# EAGLE board fmcboard_v1.5 (EAGLE 9.6.2), part 1 of 2
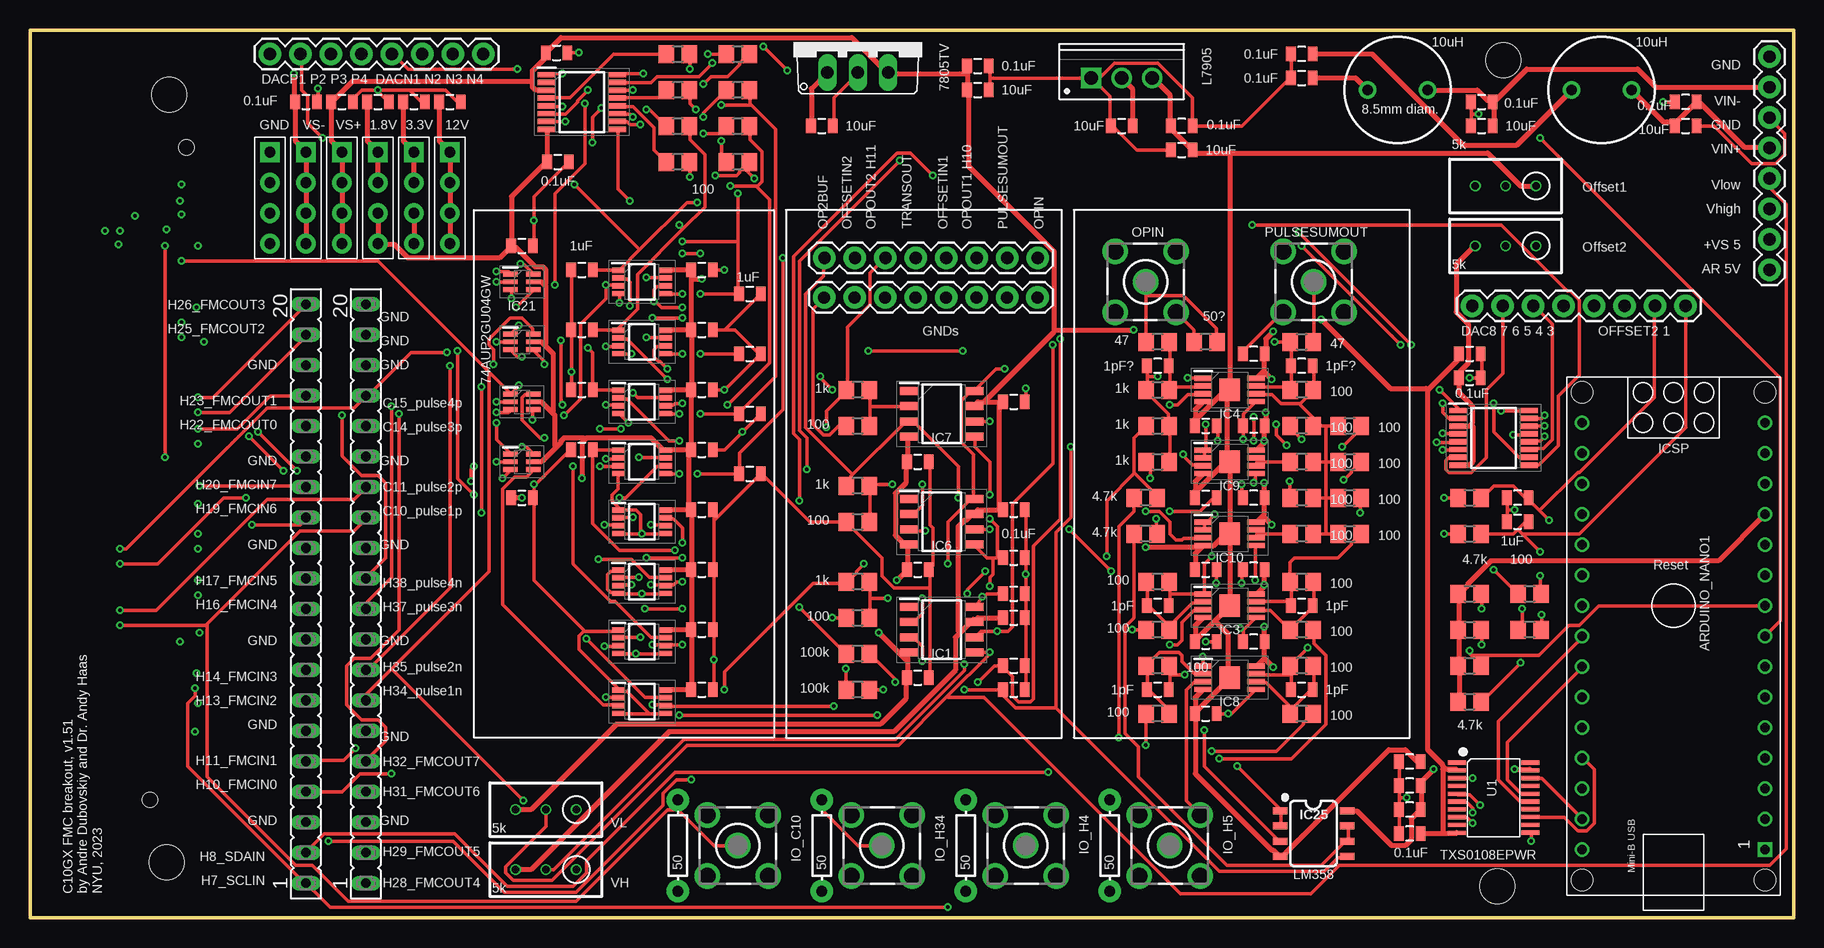
[diagram p4: board, top side]
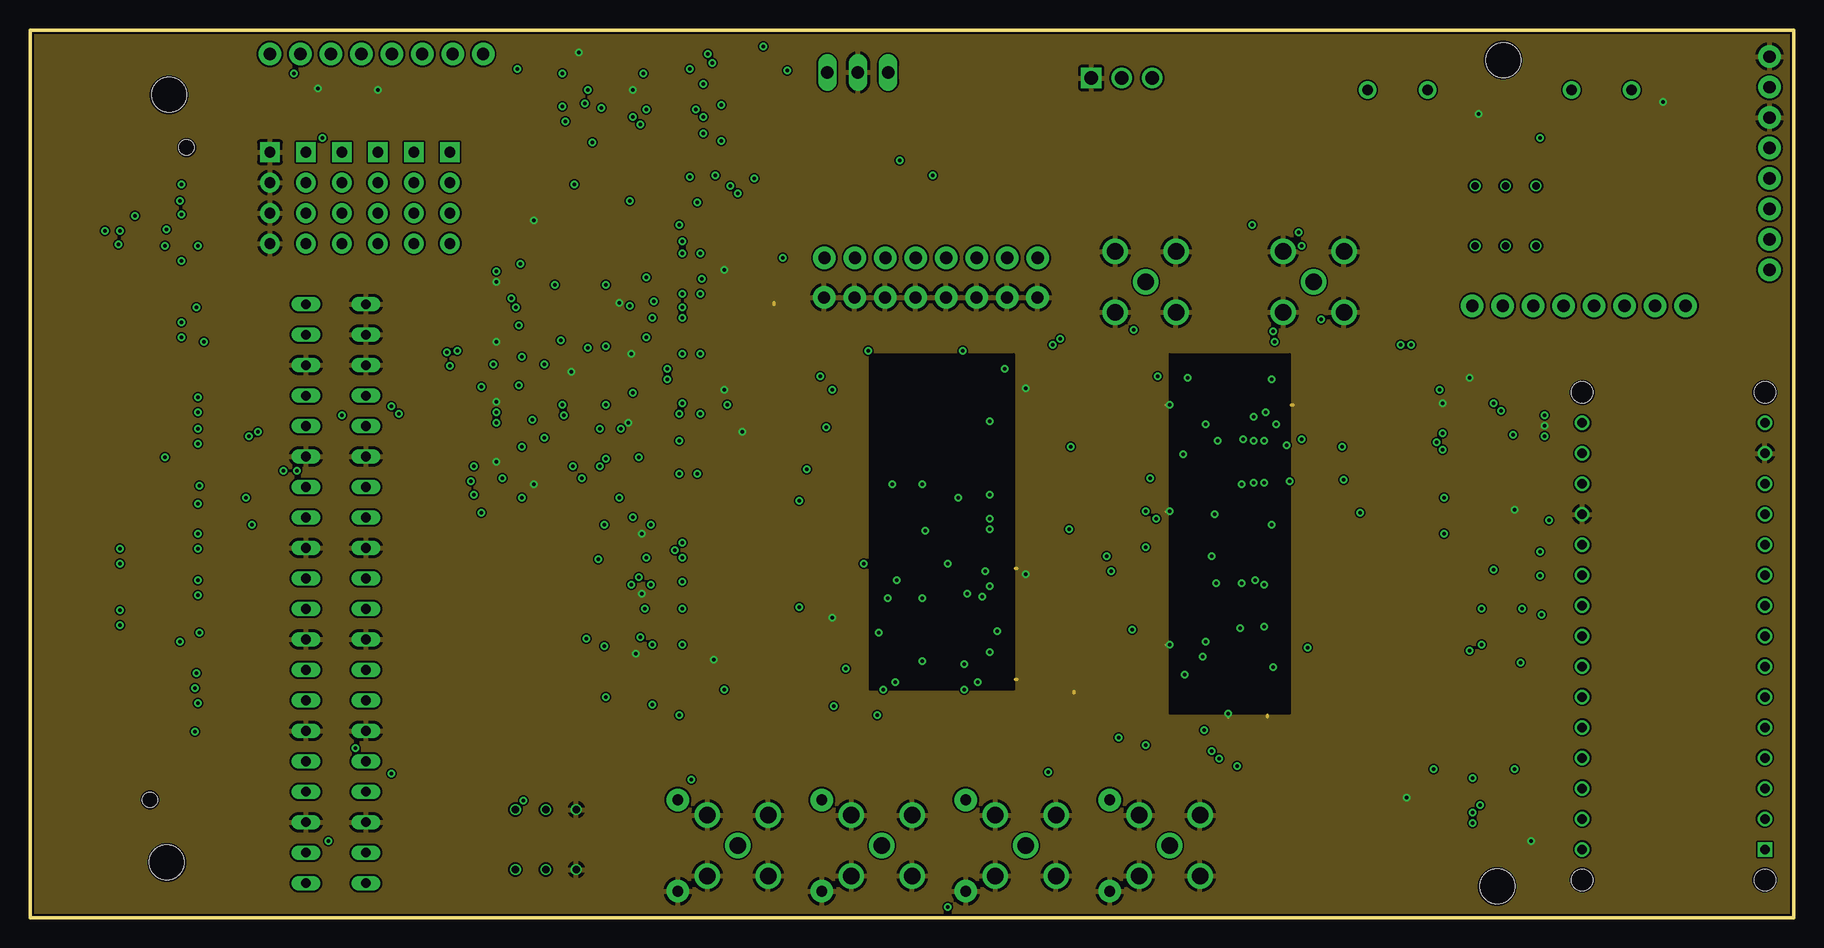
[diagram p5: board, inner layer topgnd]
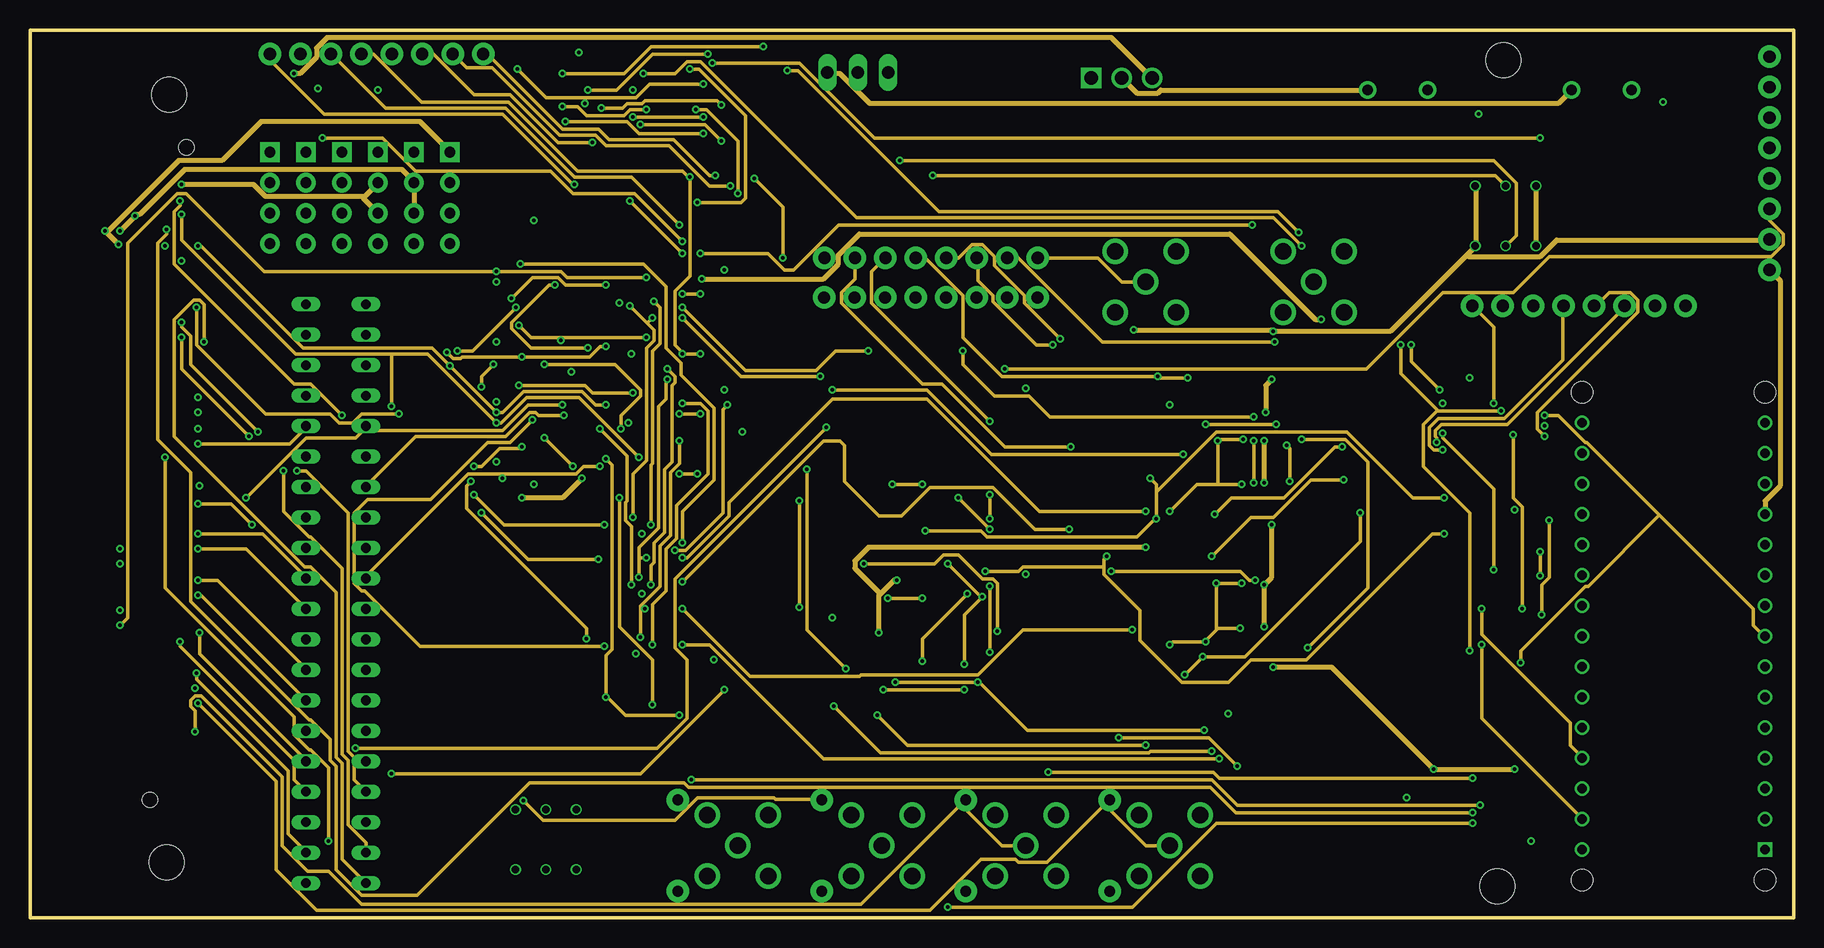
[diagram p6: board, inner layer route]
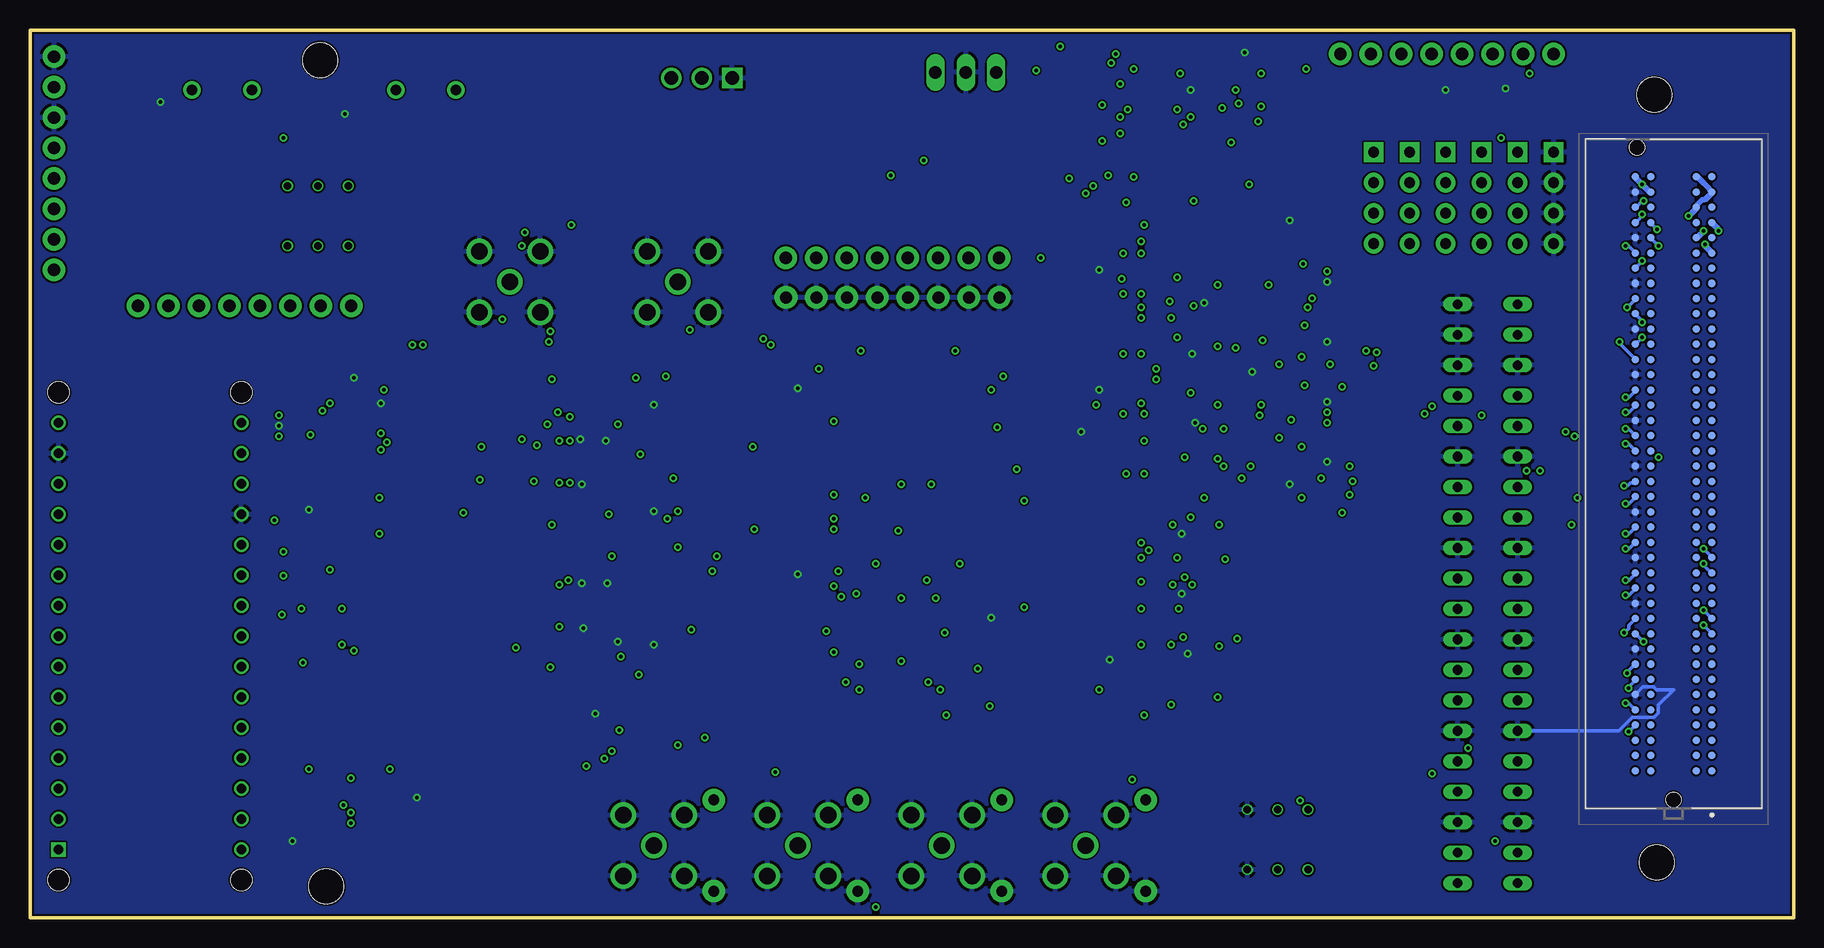
[diagram p7: board, bottom side, seen from below]

Size 147 x 74 mm. Coordinates in mm from the lower left corner, seen from the top.
Outline: 0,74 0,0 147,0 147,74 0,74
Copper layers (1*2*15*16): top 0.035mm / dielectric 0.2mm / topgnd 0.0175mm / dielectric 0.3mm / route 0.0175mm / dielectric 0.2mm / gnd 0.035mm
Design rules "Seeed_AllPCB_MacroFab_haas6mil": minimum track width 6mil, minimum drill 12mil, track to track 6mil, track to pad 6mil, pad to pad 6mil, via to via 6mil, smd to smd 0mil, copper to edge 6mil, drill to drill 6mil, minimum pad ring 6mil, minimum via ring 6mil, stop-mask expansion 6mil, vias tented up to drill 25mil, thermal gap 10mil
Net classes: 0 default: width 0.305 mm; 1 power: width 0.406 mm
Holes 2.9 mm at 11.4,4.6 122.8,71.5 11.6,68.6 122.3,2.6

## Footprints (pad centres in the part's own frame; a part is rotated, then mirrored left to right if it is on the bottom)
ARDUINO_NANO = drill 0.8 square: 1 -20.32,-7.62 | drill 0.8: 2 -17.78,-7.62; 3 -15.24,-7.62; 4 -12.7,-7.62; 5 -10.16,-7.62; 6 -7.62,-7.62; 7 -5.08,-7.62; 8 -2.54,-7.62; 9 0,-7.62; 10 2.54,-7.62; 11 5.08,-7.62; 12 7.62,-7.62; 13 10.16,-7.62; 14 12.7,-7.62; 15 15.24,-7.62; 16 15.24,7.62; 17 12.7,7.62; 18 10.16,7.62; 19 7.62,7.62; 20 5.08,7.62; 21 2.54,7.62; 22 0,7.62; 23 -2.54,7.62; 24 -5.08,7.62; 25 -7.62,7.62; 26 -10.16,7.62; 27 -12.7,7.62; 28 -15.24,7.62; 29 -17.78,7.62; 30 -20.32,7.62 | hole 1.778: -22.86,-7.62; -22.86,7.62; 17.78,7.62; 17.78,-7.62
0805 = smd 0.8 x 1.2: 1 -0.9,0; 2 0.9,0
SOIC127P600X175-8N = smd 1.528 x 0.65: 1 -2.711,1.905; 2 -2.711,0.635; 3 -2.711,-0.635; 4 -2.711,-1.905; 5 2.711,-1.905; 6 2.711,-0.635; 7 2.711,0.635; 8 2.711,1.905
SOP65P640X120-16N = smd 1.475 x 0.45: 1 -2.938,2.275; 2 -2.938,1.625; 3 -2.938,0.975; 4 -2.938,0.325; 5 -2.938,-0.325; 6 -2.938,-0.975; 7 -2.938,-1.625; 8 -2.938,-2.275; 9 2.938,-2.275; 10 2.938,-1.625; 11 2.938,-0.975; 12 2.938,-0.325; 13 2.938,0.325; 14 2.938,0.975; 15 2.938,1.625; 16 2.938,2.275
SOP65P490X110-9N = smd 1.425 x 0.45: 1 -2.212,0.975; 2 -2.212,0.325; 3 -2.212,-0.325; 4 -2.212,-0.975; 5 2.212,-0.975; 6 2.212,-0.325; 7 2.212,0.325; 8 2.212,0.975 | smd 1.68 x 1.88: 9 0,0
TO220V = drill 1.016 long: 1 -2.54,-2.54; 2 0,-2.54; 3 2.54,-2.54
SOP65P400X130-8N = smd 1.1 x 0.45: 1 -1.95,0.975; 2 -1.95,0.325; 3 -1.95,-0.325; 4 -1.95,-0.975; 5 1.95,-0.975; 6 1.95,-0.325; 7 1.95,0.325; 8 1.95,0.975
SOT65P210X110-6N = smd 1.2 x 0.4: 1 -0.95,0.65; 2 -0.95,0; 3 -0.95,-0.65; 4 0.95,-0.65; 5 0.95,0; 6 0.95,0.65
SO08 = smd 0.6 x 1.2: 1 -1.905,-2.8; 2 -0.635,-2.8; 3 0.635,-2.8; 4 1.905,-2.8; 5 1.905,2.8; 6 0.635,2.8; 7 -0.635,2.8; 8 -1.905,2.8
BU-SMB-V = drill 1.4: 1 0,0; 2 -2.54,2.54; 3 2.54,2.54; 4 2.54,-2.54; 5 -2.54,-2.54
1X08 = drill 1.016 pad 1.88: 1 0,0; 2 2.54,0; 3 5.08,0; 4 7.62,0; 5 10.16,0; 6 12.7,0; 7 15.24,0; 8 17.78,0
ASP13460401 = smd 0.64 x 0.64: C1 24.765,3.175; C2 23.495,3.175; C3 22.225,3.175; C4 20.955,3.175; C5 19.685,3.175; C6 18.415,3.175; C7 17.145,3.175; C8 15.875,3.175; C9 14.605,3.175; C10 13.335,3.175; C11 12.065,3.175; C12 10.795,3.175; C13 9.525,3.175; C14 8.255,3.175; C15 6.985,3.175; C16 5.715,3.175; C17 4.445,3.175; C18 3.175,3.175; C19 1.905,3.175; C20 0.635,3.175; C21 -0.635,3.175; C22 -1.905,3.175; C23 -3.175,3.175; C24 -4.445,3.175; C25 -5.715,3.175; C26 -6.985,3.175; C27 -8.255,3.175; C28 -9.525,3.175; C29 -10.795,3.175; C30 -12.065,3.175; C31 -13.335,3.175; C32 -14.605,3.175; C33 -15.875,3.175; C34 -17.145,3.175; C35 -18.415,3.175; C36 -19.685,3.175; C37 -20.955,3.175; C38 -22.225,3.175; C39 -23.495,3.175; C40 -24.765,3.175; D1 24.765,1.905; D2 23.495,1.905; D3 22.225,1.905; D4 20.955,1.905; D5 19.685,1.905; D6 18.415,1.905; D7 17.145,1.905; D8 15.875,1.905; D9 14.605,1.905; D10 13.335,1.905; D11 12.065,1.905; D12 10.795,1.905; D13 9.525,1.905; D14 8.255,1.905; D15 6.985,1.905; D16 5.715,1.905; D17 4.445,1.905; D18 3.175,1.905; D19 1.905,1.905; D20 0.635,1.905; D21 -0.635,1.905; D22 -1.905,1.905; D23 -3.175,1.905; D24 -4.445,1.905; D25 -5.715,1.905; D26 -6.985,1.905; D27 -8.255,1.905; D28 -9.525,1.905; D29 -10.795,1.905; D30 -12.065,1.905; D31 -13.335,1.905; D32 -14.605,1.905; D33 -15.875,1.905; D34 -17.145,1.905; D35 -18.415,1.905; D36 -19.685,1.905; D37 -20.955,1.905; D38 -22.225,1.905; D39 -23.495,1.905; D40 -24.765,1.905; G1 24.765,-1.905; G2 23.495,-1.905; G3 22.225,-1.905; G4 20.955,-1.905; G5 19.685,-1.905; G6 18.415,-1.905; G7 17.145,-1.905; G8 15.875,-1.905; G9 14.605,-1.905; G10 13.335,-1.905; G11 12.065,-1.905; G12 10.795,-1.905; G13 9.525,-1.905; G14 8.255,-1.905; G15 6.985,-1.905; G16 5.715,-1.905; G17 4.445,-1.905; G18 3.175,-1.905; G19 1.905,-1.905; G20 0.635,-1.905; G21 -0.635,-1.905; G22 -1.905,-1.905; G23 -3.175,-1.905; G24 -4.445,-1.905; G25 -5.715,-1.905; G26 -6.985,-1.905; G27 -8.255,-1.905; G28 -9.525,-1.905; G29 -10.795,-1.905; G30 -12.065,-1.905; G31 -13.335,-1.905; G32 -14.605,-1.905; G33 -15.875,-1.905; G34 -17.145,-1.905; G35 -18.415,-1.905; G36 -19.685,-1.905; G37 -20.955,-1.905; G38 -22.225,-1.905; G39 -23.495,-1.905; G40 -24.765,-1.905; H1 24.765,-3.175; H2 23.495,-3.175; H3 22.225,-3.175; H4 20.955,-3.175; H5 19.685,-3.175; H6 18.415,-3.175; H7 17.145,-3.175; H8 15.875,-3.175; H9 14.605,-3.175; H10 13.335,-3.175; H11 12.065,-3.175; H12 10.795,-3.175; H13 9.525,-3.175; H14 8.255,-3.175; H15 6.985,-3.175; H16 5.715,-3.175; H17 4.445,-3.175; H18 3.175,-3.175; H19 1.905,-3.175; H20 0.635,-3.175; H21 -0.635,-3.175; H22 -1.905,-3.175; H23 -3.175,-3.175; H24 -4.445,-3.175; H25 -5.715,-3.175; H26 -6.985,-3.175; H27 -8.255,-3.175; H28 -9.525,-3.175; H29 -10.795,-3.175; H30 -12.065,-3.175; H31 -13.335,-3.175; H32 -14.605,-3.175; H33 -15.875,-3.175; H34 -17.145,-3.175; H35 -18.415,-3.175; H36 -19.685,-3.175; H37 -20.955,-3.175; H38 -22.225,-3.175; H39 -23.495,-3.175; H40 -24.765,-3.175 | hole 1.27: 27.189,0; -27.191,-3.05
H4-2.54 = drill 0.889 pad 1.651 square: 1 0,3.81 | drill 0.889 pad 1.651: 2 0,1.27; 3 0,-1.27; 4 0,-3.81
6000-XXXX-RC = drill 0.9 pad 1.422: 1 -2.5,0; 2 2.5,0
R0805 = smd 1.3 x 1.5: 1 -0.95,0; 2 0.95,0
AXIAL-0.3 = drill 0.9 pad 1.88: P$1 -3.81,0; P$2 3.81,0
RTRIM3296W = drill 0.61: 1 0,-2.54; 2 0,0; 3 0,2.54
FE20 = drill 0.813 long: 1 -24.13,0; 2 -21.59,0; 3 -19.05,0; 4 -16.51,0; 5 -13.97,0; 6 -11.43,0; 7 -8.89,0; 8 -6.35,0; 9 -3.81,0; 10 -1.27,0; 11 1.27,0; 12 3.81,0; 13 6.35,0; 14 8.89,0; 15 11.43,0; 16 13.97,0; 17 16.51,0; 18 19.05,0; 19 21.59,0; 20 24.13,0
TSSOP20-0.65-6.5X4.4MM = smd 0.35 x 1.5: 1 -2.925,-3.065; 2 -2.275,-3.065; 3 -1.625,-3.065; 4 -0.975,-3.065; 5 -0.325,-3.065; 6 0.325,-3.065; 7 0.975,-3.065; 8 1.625,-3.065; 9 2.275,-3.065; 10 2.925,-3.065; 11 2.91,3.065; 12 2.26,3.065; 13 1.61,3.065; 14 0.96,3.065; 15 0.325,3.065; 16 -0.325,3.065; 17 -0.975,3.065; 18 -1.625,3.065; 19 -2.275,3.065; 20 -2.925,3.065
STMICROELECTRONICS_L7905ACV_0 = drill 1.1 pad 1.7 square: 1 -2.54,0 | drill 1.1 pad 1.7: 2 0,0; 3 2.54,0

## Placement (x,y rotation side)
ARDUINO_NANO1  1  [ARDUINO_NANO]  137,26 90 top
C1  10uF  [0805]  138,66 0 top
C2  10uF  [0805]  66,66 0 top
C3  0.1uF  [0805]  26,68 0 top
C4  0.1uF  [0805]  82,19 0 top
C5  0.1uF  [0805]  29,68 0 top
C6  0.1uF  [0805]  115,11 180 top
C7  0.1uF  [0805]  82,27 0 top
C8  0.1uF  [0805]  82,30 0 top
C9  0.1uF  [0805]  115,9 180 top
C10  0.1uF  [0805]  23,68 0 top
C11  0.1uF  [0805]  82,21 0 top
C12  0.1uF  [0805]  35,68 0 top
C13  0.1uF  [0805]  32,68 0 top
C14  0.1uF  [0805]  115,7 180 top
C15  0.1uF  [0805]  115,13 180 top
C16  0.1uF  [0805]  102,47 180 top
C17  0.1uF  [0805]  98,41 0 top
C18  0.1uF  [0805]  102,41 180 top
C19  0.1uF  [0805]  98,35 0 top
C20  0.1uF  [0805]  102,35 180 top
C21  0.1uF  [0805]  98,29 0 top
C22  0.1uF  [0805]  102,29 180 top
C23  0.1uF  [0805]  98,23 0 top
C24  0.1uF  [0805]  102,23 180 top
C25  0.1uF  [0805]  98,17 0 top
C26  0.1uF  [0805]  82,43 0 top
C27  0.1uF  [0805]  74,38 0 top
C28  0.1uF  [0805]  82,34 0 top
C29  0.1uF  [0805]  74,29 0 top
C30  0.1uF  [0805]  82,25 0 top
C31  0.1uF  [0805]  74,20 0 top
C32  1pF?  [0805]  106,46 180 top
C33  1pF?  [0805]  94,46 180 top
C34  1pF  [0805]  94,26 0 top
C35  1pF  [0805]  94,19 0 top
C36  1pF  [0805]  106,26 0 top
C37  1pF  [0805]  106,19 0 top
C38  10uF  [0805]  79,69 0 top
C39  10uF  [0805]  96,64 0 top
C40  10uF  [0805]  91,66 0 top
C41  10uF  [0805]  121,66 0 top
C42  0.1uF  [0805]  138,68 180 top
C43  0.1uF  [0805]  106,72 180 top
C44  0.1uF  [0805]  121,68 0 top
C45  0.1uF  [0805]  106,70 0 top
C46  0.1uF  [0805]  96,66 180 top
C47  0.1uF  [0805]  79,71 0 top
C48  0.1uF  [0805]  43.9,72.1 0 top
C49  0.1uF  [0805]  44,63 0 top
C50  0.1uF  [0805]  56,54 0 top
C51  0.1uF  [0805]  56,49 0 top
C52  0.1uF  [0805]  56,44 0 top
C53  0.1uF  [0805]  56,39 0 top
C54  0.1uF  [0805]  120,45 0 top
C55  0.1uF  [0805]  120,47 0 top
C56  1uF  [0805]  46,39 0 top
C57  1uF  [0805]  46,44 0 top
C58  1uF  [0805]  46,49 0 top
C59  1uF  [0805]  46,54 0 top
C60  1uF  [0805]  60,37 0 top
C61  1uF  [0805]  60,42 0 top
C62  1uF  [0805]  60,47 0 top
C63  1uF  [0805]  60,52 0 top
C64  1uF  [0805]  124,33 0 top
C65  1uF  [0805]  124,35 180 top
C66  0.1uF  [0805]  56,24 0 top
C67  0.1uF  [0805]  56,19 0 top
C68  0.1uF  [0805]  56,29 0 top
C69  0.1uF  [0805]  56,34 0 top
C70  0.1uF  [0805]  41,56 0 top
C71  0.1uF  [0805]  41,35 0 top
IC1  OPA699ID  [SOIC127P600X175-8N]  76,24 0 top
IC2  DAC7578SPWR  [SOP65P640X120-16N]  46,68 0 top
IC3  LTC6229IMS8E#TRPBF  [SOP65P490X110-9N]  100,26 0 top
IC4  LTC6229IMS8E#TRPBF  [SOP65P490X110-9N]  100,44 0 top
IC6  OPA699ID  [SOIC127P600X175-8N]  76,33 0 top
IC7  OPA699ID  [SOIC127P600X175-8N]  76,42 0 top
IC8  LTC6229IMS8E#TRPBF  [SOP65P490X110-9N]  100,20 0 top
IC9  LTC6229IMS8E#TRPBF  [SOP65P490X110-9N]  100,38 0 top
IC10  LTC6229IMS8E#TRPBF  [SOP65P490X110-9N]  100,32 0 top
IC11  7805TV  [TO220V]  69,73 0 top
IC12  SN74AUC2G66DCTR  [SOP65P400X130-8N]  51,53 0 top
IC13  SN74AUC2G66DCTR  [SOP65P400X130-8N]  51,48 0 top
IC14  SN74AUC2G66DCTR  [SOP65P400X130-8N]  51,43 0 top
IC15  SN74AUC2G66DCTR  [SOP65P400X130-8N]  51,38 0 top
IC16  DAC7578SPWR  [SOP65P640X120-16N]  122,40 0 top
IC17  SN74AUC2G66DCTR  [SOP65P400X130-8N]  51,33 0 top
IC18  SN74AUC2G66DCTR  [SOP65P400X130-8N]  51,28 0 top
IC19  SN74AUC2G66DCTR  [SOP65P400X130-8N]  51,23 0 top
IC20  SN74AUC2G66DCTR  [SOP65P400X130-8N]  51,18 0 top
IC21  74AUP2GU04GW  [SOT65P210X110-6N]  41,53 0 top
IC22  74AUP2GU04GW  [SOT65P210X110-6N]  41,43 0 top
IC23  74AUP2GU04GW  [SOT65P210X110-6N]  41,48 0 top
IC24  74AUP2GU04GW  [SOT65P210X110-6N]  41,38 0 top
IC25  LM358  [SO08]  107,7 270 top
IO_C10  BU-SMB-V  [BU-SMB-V]  59,6 270 top
IO_H4  BU-SMB-V  [BU-SMB-V]  83,6 270 top
IO_H5  BU-SMB-V  [BU-SMB-V]  95,6 270 top
IO_H34  BU-SMB-V  [BU-SMB-V]  71,6 270 top
J1  8pin  [1X08]  145,54 90 top
J2  ASP-134604-01  [ASP13460401]  10,37 270 bottom
J3  4p-2.54  [H4-2.54]  32,60 0 top
J4  4p-2.54  [H4-2.54]  20,60 0 top
J5  8pin  [1X08]  84,55 180 top
J6  4p-2.54  [H4-2.54]  26,60 0 top
J7  4p-2.54  [H4-2.54]  23,60 0 top
J8  4p-2.54  [H4-2.54]  35,60 0 top
J9  8pin  [1X08]  20,72 0 top
J10  8pin  [1X08]  138,51 180 top
J11  8pin  [1X08]  66.2,51.7 0 top
J12  4p-2.54  [H4-2.54]  29,60 0 top
L1  10uH  [6000-XXXX-RC]  131,69 180 top
L2  10uH  [6000-XXXX-RC]  114,69 180 top
OPIN  BU-SMB-V  [BU-SMB-V]  93,53 90 top
PULSESUMOUT  BU-SMB-V  [BU-SMB-V]  107,53 0 top
R1  100  [R0805]  106,44 180 top
R2  47  [R0805]  94,48 180 top
R3  100k  [R0805]  69,22 180 top
R4  50  [AXIAL-0.3]  54,6 90 top
R5  50  [AXIAL-0.3]  66,6 90 top
R6  1k  [R0805]  69,44 180 top
R7  100  [R0805]  106,35 180 top
R8  100  [R0805]  110,41 0 top
R9  1k  [R0805]  69,28 180 top
R10  100  [R0805]  69,25 0 top
R11  1k  [R0805]  94,44 0 top
R12  100  [R0805]  110,38 0 top
R13  1k  [R0805]  94,41 0 top
R14  4.7k  [R0805]  93,35 180 top
R15  50  [AXIAL-0.3]  78,6 90 top
R16  50  [AXIAL-0.3]  90,6 90 top
R17  100k  [R0805]  69,19 180 top
R18  1k  [R0805]  69,36 180 top
R19  100  [R0805]  69,33 0 top
R20  1k  [R0805]  94,38 0 top
R21  100  [R0805]  94,28 180 top
R22  100  [R0805]  94,24 180 top
R23  100  [R0805]  106,28 180 top
R24  100  [R0805]  106,24 180 top
R25  4.7k  [R0805]  93,32 180 top
R26  100  [R0805]  69,41 0 top
R27  100  [R0805]  94,21 180 top
R28  100  [R0805]  94,17 180 top
R29  100  [R0805]  106,21 180 top
R30  100  [R0805]  106,17 180 top
R31  4.7k  [R0805]  120,35 0 top
R32  100  [R0805]  110,35 0 top
R33  100  [R0805]  106,38 180 top
R34  47  [R0805]  106,48 0 top
R35  4.7k  [R0805]  120,32 0 top
R36  100  [R0805]  106,32 180 top
R38  100  [R0805]  110,32 0 top
R40  100  [R0805]  106,41 180 top
R42  50?  [R0805]  98,48 180 top
R47  100  [R0805]  54,72 0 top
R48  4.7k  [R0805]  120,18 0 top
R49  4.7k  [R0805]  120,21 0 top
R50  4.7k  [R0805]  120,24 0 top
R51  4.7k  [R0805]  120,27 0 top
R53  100  [R0805]  54,66 0 top
R54  100  [R0805]  59,72 0 top
R55  100  [R0805]  59,66 0 top
R56  100  [R0805]  54,69 180 top
R57  100  [R0805]  54,63 180 top
R58  100  [R0805]  59,69 180 top
R59  100  [R0805]  59,63 180 top
R60  100  [R0805]  125,27 0 top
R61  100  [R0805]  125,24 180 top
R_O1  5k  [RTRIM3296W]  123,61 90 top
R_O2  5k  [RTRIM3296W]  123,56 90 top
R_VH  5k  [RTRIM3296W]  43,4 90 top
R_VL  5k  [RTRIM3296W]  43,9 90 top
SV1  20  [FE20]  23,27 90 top
SV2  20  [FE20]  28,27 90 top
U1  TXS0108EPWR  [TSSOP20-0.65-6.5X4.4MM]  122,10 270 top
U2  STMICROELECTRONICS_L7905ACVSTMICROELECTRONICS_L7905ACV_0_0  [STMICROELECTRONICS_L7905ACV_0]  91,70 0 top